# Altium project S6_Main_hv3.PrjPcb
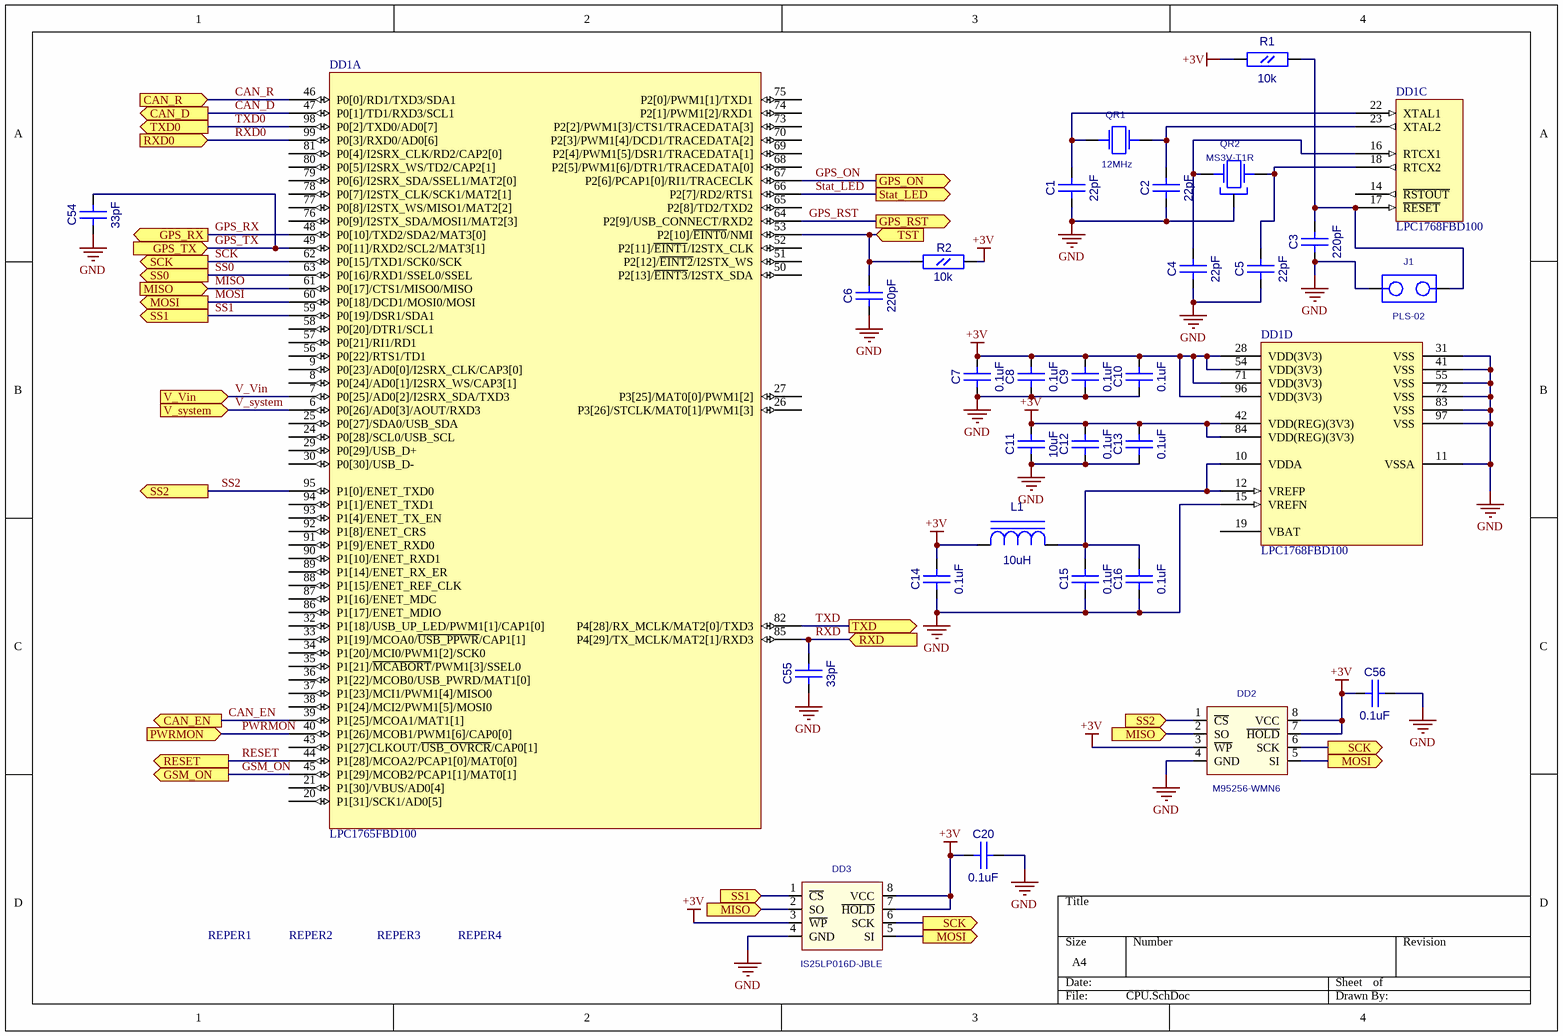
[diagram p0: CPU.SchDoc]
4 sheets, 128 parts. Net scope: flat (ports and power ports of the same name join across sheets).
Board file: S6_Main_hv3.PcbDoc
Sheets:
  CPU.SchDoc
  Interface.SchDoc
  IO.SchDoc
  Power.SchDoc

## Sheet CPU.SchDoc
size A4

### Parts
C1  22pF  [CC0603]
C2  22pF  [CC0603]
C3  220pF  [CC0603]
C4  22pF  [CC0603]
C5  22pF  [CC0603]
C6  220pF  [CC0603]
C7  0.1uF  [CC0603]
C8  0.1uF  [CC0603]
C9  0.1uF  [CC0603]
C10  0.1uF  [CC0603]
C11  10uF  [CC0805]
C12  0.1uF  [CC0603]
C13  0.1uF  [CC0603]
C14  0.1uF  [CC0603]
C15  0.1uF  [CC0603]
C16  0.1uF  [CC0603]
C20  0.1uF  [CC0603]
C54  33pF  [CC0603]
C55  33pF  [CC0603]
C56  0.1uF  [CC0603]
DD1  LPC1765FBD100  [TQFP-100]  (parts A,C,D of 4)
DD2  M95256-WMN6  [SO-8]
DD3  IS25LP016D-JBLE  [EIAJ_SO8]
J1  PLS-02  [PLS-02]
L1  10uH  [L0603]
QR1  12MHz  [AC5032_2]
QR2  MS3V-T1R  [MS3V-T1R]
R1  10k  [RC0603]
R2  10k  [RC0603]
REPER1  REPER1.2  [REPER1.2]  (value not drawn)
REPER2  REPER1.2  [REPER1.2]  (value not drawn)
REPER3  REPER1.2  [REPER1.2]  (value not drawn)
REPER4  REPER1.2  [REPER1.2]  (value not drawn)

### Ports
CAN_D (out), CAN_EN (out), CAN_R (in), GPS_ON (out), GPS_RST (out), GPS_RX (out), GPS_TX (in), GSM_ON (out), MISO (in), MOSI (out), PWRMON (in), RESET (out), RXD0 (in), RXD (in), SCK (out), SS0 (out), SS1 (in), SS1 (out), SS2 (in), SS2 (out), Stat_LED (out), TST (in), TXD0 (out), TXD (out), V_system (in), V_Vin (in)

### Nets
+3V: C7.2(B) C8.2(B) C9.2(B) C10.2(B) C11.2(B) C12.2(B) C13.2(B) C14.2(B) C20.1(A) C56.1(A) DD1.28(VDD(3V3)) DD1.42(VDD(REG)(3V3)) DD1.54(VDD(3V3)) DD1.71(VDD(3V3)) DD1.84(VDD(REG)(3V3)) DD1.96(VDD(3V3)) DD2.3(~{WP}) DD2.7(~{HOLD}) DD2.8(VCC) DD3.3(~{WP}) DD3.7(~{HOLD}) DD3.8(VCC) L1.1(A) R1.1(A) R2.1(A)
GND: C1.1(A) C2.1(A) C3.1(A) C4.1(A) C5.1(A) C6.1(A) C7.1(A) C8.1(A) C9.1(A) C10.1(A) C11.1(A) C12.1(A) C13.1(A) C14.1(A) C15.1(A) C16.1(A) C20.2(B) C54.1(A) C55.1(A) C56.2(B) DD1.11(VSSA) DD1.15(VREFN) DD1.31(VSS) DD1.41(VSS) DD1.55(VSS) DD1.72(VSS) DD1.83(VSS) DD1.97(VSS) DD2.4(GND) DD3.4(GND) J1.1 QR2.3
CAN_D: DD1.47(P0[1]/TD1/RXD3/SCL1) ; port CAN_D
CAN_EN: DD1.39(P1[25]/MCOA1/MAT1[1]) ; port CAN_EN
CAN_R: DD1.46(P0[0]/RD1/TXD3/SDA1) ; port CAN_R
GPS_ON: DD1.67(P2[6]/PCAP1[0]/RI1/TRACECLK) ; port GPS_ON
GPS_RST: DD1.64(P2[9]/USB_CONNECT/RXD2) ; port GPS_RST
GPS_RX: DD1.48(P0[10]/TXD2/SDA2/MAT3[0]) ; port GPS_RX
GPS_TX: C54.2(B) DD1.49(P0[11]/RXD2/SCL2/MAT3[1]) ; port GPS_TX
GSM_ON: DD1.45(P1[29]/MCOB2/PCAP1[1]/MAT0[1]) ; port GSM_ON
MISO: DD1.61(P0[17]/CTS1/MISO0/MISO) DD2.2(SO) DD3.2(SO) ; port MISO
MOSI: DD1.60(P0[18]/DCD1/MOSI0/MOSI) DD2.5(SI) DD3.5(SI) ; port MOSI
PWRMON: DD1.40(P1[26]/MCOB1/PWM1[6]/CAP0[0]) ; port PWRMON
RESET: DD1.44(P1[28]/MCOA2/PCAP1[0]/MAT0[0]) ; port RESET
RXD: C55.2(B) DD1.85(P4[29]/TX_MCLK/MAT2[1]/RXD3) ; port RXD
RXD0: DD1.99(P0[3]/RXD0/AD0[6]) ; port RXD0
SCK: DD1.62(P0[15]/TXD1/SCK0/SCK) DD2.6(SCK) DD3.6(SCK) ; port SCK
SS0: DD1.63(P0[16]/RXD1/SSEL0/SSEL) ; port SS0
SS1: DD1.59(P0[19]/DSR1/SDA1) DD3.1(~{CS}) ; port SS1
SS2: DD1.95(P1[0]/ENET_TXD0) DD2.1(~{CS}) ; port SS2
Stat_LED: DD1.66(P2[7]/RD2/RTS1) ; port Stat_LED
TXD: DD1.82(P4[28]/RX_MCLK/MAT2[0]/TXD3) ; port TXD
TXD0: DD1.98(P0[2]/TXD0/AD0[7]) ; port TXD0
V_system: DD1.6(P0[26]/AD0[3]/AOUT/RXD3) ; port V_system
V_Vin: DD1.7(P0[25]/AD0[2]/I2SRX_SDA/TXD3) ; port V_Vin
NetC1_2: C1.2(B) DD1.22(XTAL1) QR1.1
NetC2_2: C2.2(B) DD1.23(XTAL2) QR1.2
NetC3_2: C3.2(B) DD1.17(~{RESET}) J1.2 R1.2(B)
NetC4_2: C4.2(B) DD1.16(RTCX1) QR2.2(X2)
NetC5_2: C5.2(B) DD1.18(RTCX2) QR2.1(X1)
NetC6_2: C6.2(B) DD1.53(P2[10]/~{EINT0}/NMI) R2.2(B) ; port TST
NetC15_2: C15.2(B) C16.2(B) DD1.10(VDDA) DD1.12(VREFP) L1.2(C)

Not connected (* = marked no-connect by the designer): DD1 8(P0[24]/AD0[1]/I2SRX_WS/CAP3[1]) 9(P0[23]/AD0[0]/I2SRX_CLK/CAP3[0]) 14(~{RSTOUT}) 19(VBAT) 20(P1[31]/SCK1/AD0[5]) 21(P1[30]/VBUS/AD0[4]) 24(P0[28]/SCL0/USB_SCL) 25(P0[27]/SDA0/USB_SDA) 26(P3[26]/STCLK/MAT0[1]/PWM1[3]) 27(P3[25]/MAT0[0]/PWM1[2]) 29(P0[29]/USB_D+) 30(P0[30]/USB_D-) 32(P1[18]/USB_UP_LED/PWM1[1]/CAP1[0]) 33(P1[19]/MCOA0/~{USB_PPWR}/CAP1[1]) 34(P1[20]/MCI0/PWM1[2]/SCK0) 35(P1[21]/~{MCABORT}/PWM1[3]/SSEL0) 36(P1[22]/MCOB0/USB_PWRD/MAT1[0]) 37(P1[23]/MCI1/PWM1[4]/MISO0) 38(P1[24]/MCI2/PWM1[5]/MOSI0) 43(P1[27]CLKOUT/~{USB_OVRCR}/CAP0[1]) 50(P2[13]/~{EINT3}/I2STX_SDA) 51(P2[12]/~{EINT2}/I2STX_WS) 52(P2[11]/~{EINT1}/I2STX_CLK) 56(P0[22]/RTS1/TD1) 57(P0[21]/RI1/RD1) 58(P0[20]/DTR1/SCL1) 65(P2[8]/TD2/TXD2) 68(P2[5]/PWM1[6]/DTR1/TRACEDATA[0]) 69(P2[4]/PWM1[5]/DSR1/TRACEDATA[1]) 70(P2[3]/PWM1[4]/DCD1/TRACEDATA[2]) 73(P2[2]/PWM1[3]/CTS1/TRACEDATA[3]) 74(P2[1]/PWM1[2]/RXD1) 75(P2[0]/PWM1[1]/TXD1) 76(P0[9]/I2STX_SDA/MOSI1/MAT2[3]) 77(P0[8]/I2STX_WS/MISO1/MAT2[2]) 78(P0[7]/I2STX_CLK/SCK1/MAT2[1]) 79(P0[6]/I2SRX_SDA/SSEL1/MAT2[0]) 80(P0[5]/I2SRX_WS/TD2/CAP2[1]) 81(P0[4]/I2SRX_CLK/RD2/CAP2[0]) 86(P1[17]/ENET_MDIO) 87(P1[16]/ENET_MDC) 88(P1[15]/ENET_REF_CLK) 89(P1[14]/ENET_RX_ER) 90(P1[10]/ENET_RXD1) 91(P1[9]/ENET_RXD0) 92(P1[8]/ENET_CRS) 93(P1[4]/ENET_TX_EN) 94(P1[1]/ENET_TXD1); REPER1 1; REPER2 1; REPER3 1; REPER4 1

### Library data of the parts
C1-C10 C12-C16 C20 C54-C56 = CC0603
  C1 C2 C4 C5: Value: 22pF
  C3 C6: Value: 220pF
  C7-C10 C12-C16 C20 C56: Value: 0.1uF
  C54 C55: Value: 33pF
C11 = CC0805: Value: 10uF
DD1 = LPC1768FBD100: Cortex -M3 32-Bit Microcontroller, 512KB Flash, 64KB RAM, 100-Lead LQFP; ComponentLink1Description: Manufacturer Link; ComponentLink1URL: http://www.nxp.com/
DD2 = M95256-WMN6: SPI EEPROM; Value: *
DD3 = S25FL016A0LMFI01: Value: IS25LP016D-JBLE
L1 = L0603: Value: 10uH
QR1 = AC5032_2: AC5032/2; Value: 12MHz
QR2 = MS3V-T1R: CRYSTAL_32768 Hz; Value: *
R1 R2 = RC0603: Value: 10k
J1 = PLS-02: Value: *
REPER1-REPER4 = REPER1.2: Value: *

## Sheet Interface.SchDoc
size A4
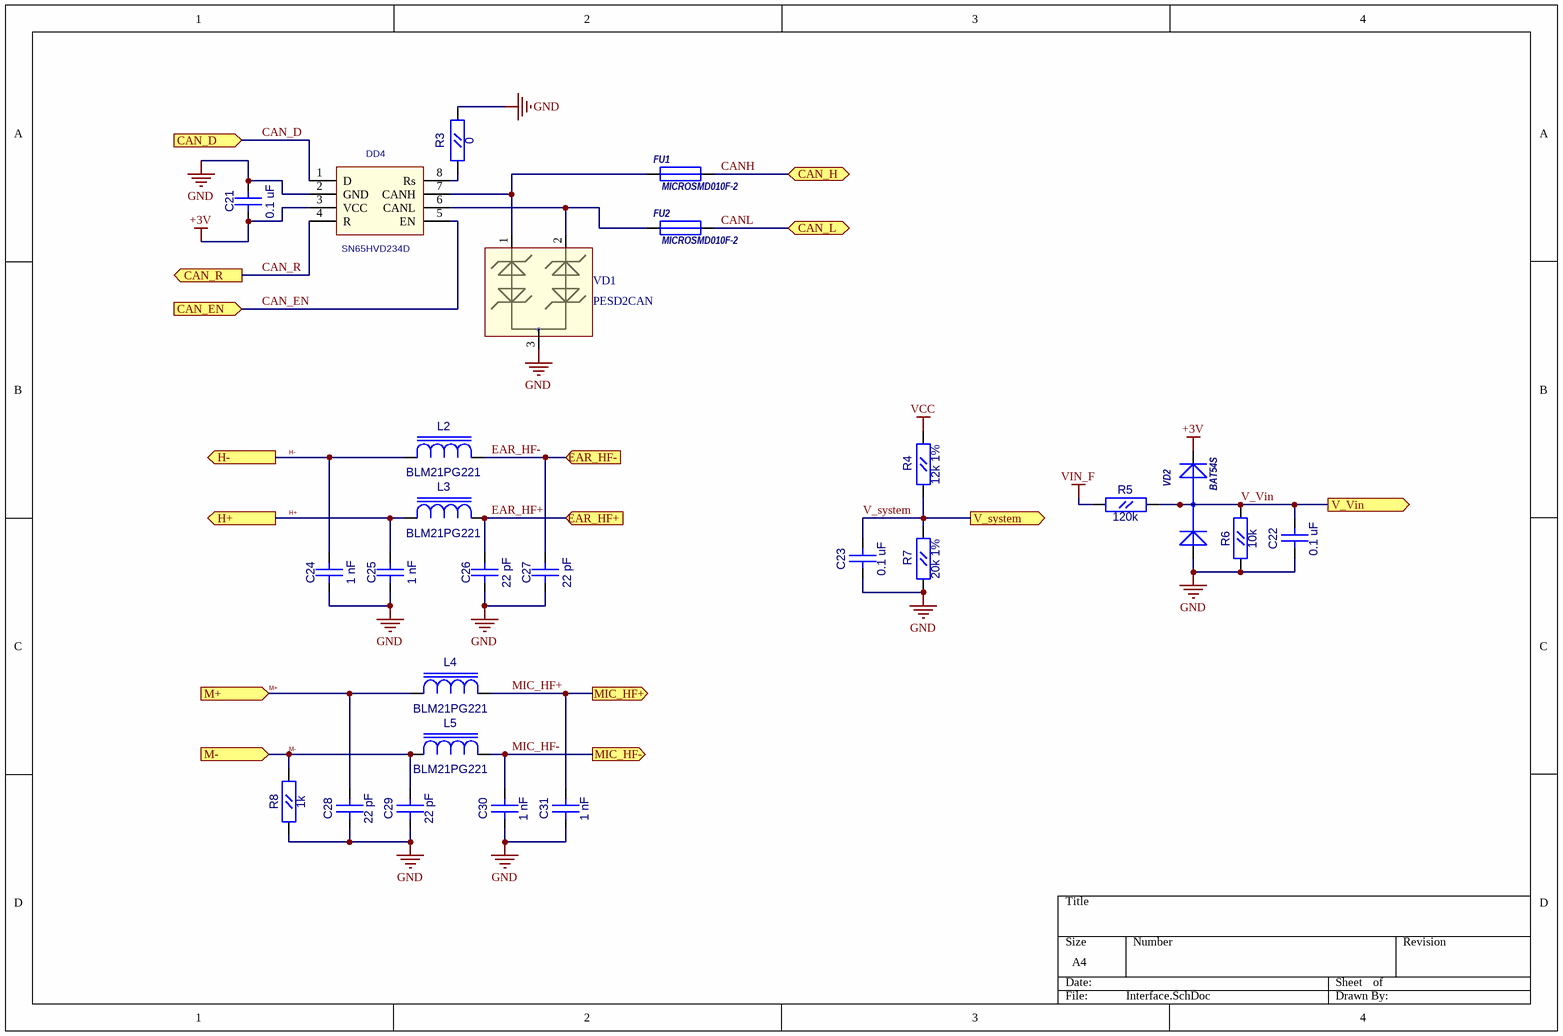
[diagram p1: Interface.SchDoc]

### Parts
C21  0.1 uF  [CC0603]
C22  0.1 uF  [CC0603]
C23  0.1 uF  [CC0603]
C24  1 nF  [CC0603]
C25  1 nF  [CC0603]
C26  22 pF  [CC0603]
C27  22 pF  [CC0603]
C28  22 pF  [CC0603]
C29  22 pF  [CC0603]
C30  1 nF  [CC0603]
C31  1 nF  [CC0603]
DD4  SN65HVD234D  [SO-8]
FU1  MICROSMD010F-2  [RC1210]
FU2  MICROSMD010F-2  [RC1210]
L2  BLM21PG221  [RC0805]
L3  BLM21PG221  [RC0805]
L4  BLM21PG221  [RC0805]
L5  BLM21PG221  [RC0805]
R3  0  [RC0603]
R4  12k 1%  [RC0603]
R5  120k  [RC0603]
R6  10k  [RC0603]
R7  20k 1%  [RC0603]
R8  1k  [RC0603]
VD1  PESD2CAN  [SOT-23(123)]
VD2  BAT54S  [SOT-23(GSD)]

### Ports
CAN_D (in), CAN_EN (in), CAN_H (bidir), CAN_L (bidir), CAN_R (out), EAR_HF+ (in), EAR_HF- (in), H+ (out), H- (out), M+ (in), M- (in), MIC_HF+ (out), MIC_HF- (out), V_system (out), V_Vin (out)

### Nets
+3V: C21.1(A) DD4.3(VCC) VD2.2(K)
GND: C21.2(B) C22.2(B) C23.2(B) C24.1(A) C25.1(A) C26.1(A) C27.1(A) C28.1(A) C29.1(A) C30.1(A) C31.1(A) DD4.2(GND) R3.2(B) R6.2(B) R7.1(A) R8.1(A) VD1.3 VD2.1(A)
VCC: R4.2(B)
VIN_F: R5.2(B)
CAN_D: DD4.1(D) ; port CAN_D
CAN_EN: DD4.5(EN) ; port CAN_EN
CAN_R: DD4.4(R) ; port CAN_R
CANH: FU1.2 ; port CAN_H
CANL: FU2.2 ; port CAN_L
EAR_HF+: C26.2(B) L3.1(A) ; port EAR_HF+
EAR_HF-: C27.2(B) L2.1(A) ; port EAR_HF-
H+: C25.2(B) L3.2(B) ; port H+
H-: C24.2(B) L2.2(B) ; port H-
M+: C28.2(B) L4.1(A) ; port M+
M-: C29.2(B) L5.1(A) R8.2(B) ; port M-
MIC_HF+: C31.2(B) L4.2(B) ; port MIC_HF+
MIC_HF-: C30.2(B) L5.2(B) ; port MIC_HF-
V_system: C23.1(A) R4.1(A) R7.2(B) ; port V_system
V_Vin: C22.1(A) R5.1(A) R6.1(A) VD2.3(AK) ; port V_Vin
NetDD4_6: DD4.6(CANL) FU2.1 VD1.2
NetDD4_7: DD4.7(CANH) FU1.1 VD1.1
NetDD4_8: DD4.8(Rs) R3.1(A)

### Library data of the parts
C21-C31 = CC0603
  C21-C23: Value: 0.1 uF
  C24 C25 C30 C31: Value: 1 nF
  C26-C29: Value: 22 pF
DD4 = SN65HVD234D: CAN Transceiver; Value: *
FU1 FU2 = MICROSMD: Value: MICROSMD010F-2
R3-R8 = RC0603
  R3: Value: 0
  R4: Value: 12k 1%
  R5: Value: 120k
  R6: Value: 10k
  R7: Value: 20k 1%
  R8: Value: 1k
VD1 = PESD2CAN: TVS for CAN
VD2 = BAT54S: 1.0 Ampere General Purpose Rectifier; ComponentField6: Published 8-Jun-2000, Modified 11-July-2000: SIM Model Added.; Value: *

## Sheet IO.SchDoc
size A4
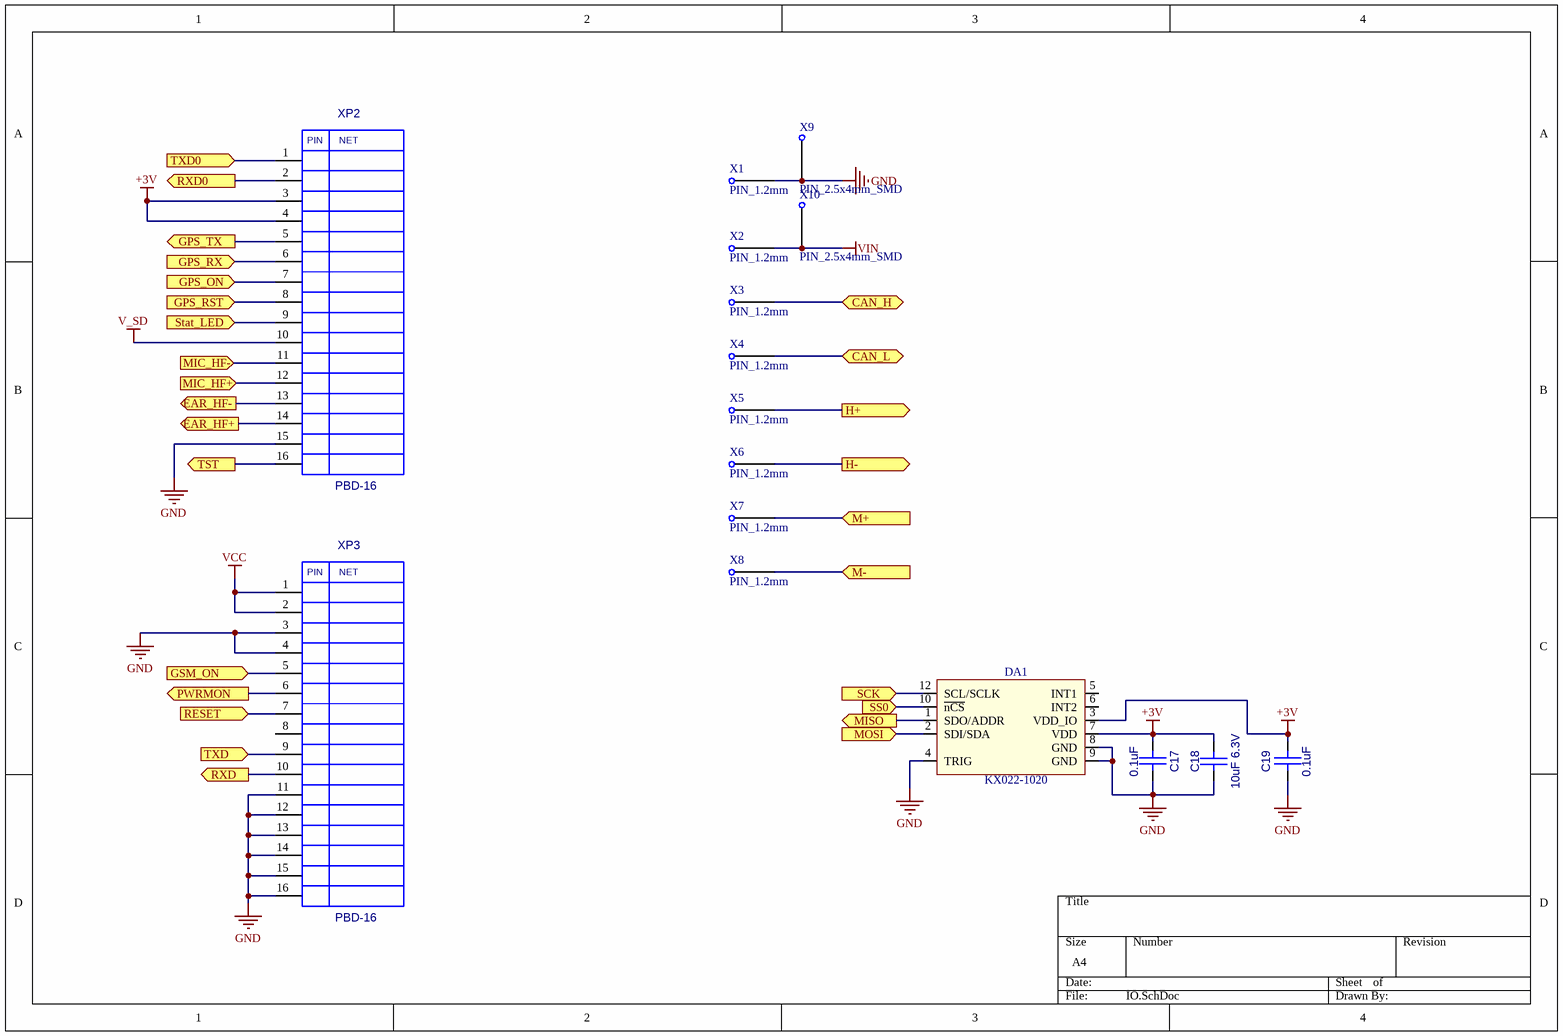
[diagram p2: IO.SchDoc]

### Parts
C17  0.1uF  [CC0603]
C18  10uF 6.3V  [CC0805]
C19  0.1uF  [CC0603]
DA1  KX022-1020  [LGA-12]
X1  PIN_1.2mm  [PIN_1.2mm]
X2  PIN_1.2mm  [PIN_1.2mm]
X3  PIN_1.2mm  [PIN_1.2mm]
X4  PIN_1.2mm  [PIN_1.2mm]
X5  PIN_1.2mm  [PIN_1.2mm]
X6  PIN_1.2mm  [PIN_1.2mm]
X7  PIN_1.2mm  [PIN_1.2mm]
X8  PIN_1.2mm  [PIN_1.2mm]
X9  PIN_2.5x4mm_SMD  [PIN_2.5x4mm_SMD]
X10  PIN_2.5x4mm_SMD  [PIN_2.5x4mm_SMD]
XP2  PBD-16  [PBD16]
XP3  PBD-16  [PBD16]

### Ports
CAN_H (bidir), CAN_L (bidir), EAR_HF+ (out), EAR_HF- (out), GPS_ON (in), GPS_RST (in), GPS_RX (in), GPS_TX (out), GSM_ON (in), H+ (out), H- (out), M+ (in), M- (in), MIC_HF+ (in), MIC_HF- (in), MISO (out), MOSI (in), PWRMON (out), RESET (in), RXD0 (out), RXD (out), SCK (in), SS0 (in), Stat_LED (in), TST (out), TXD0 (in), TXD (in)

### Nets
+3V: C17.1(A) C18.2(B) C19.1(A) DA1.3(VDD_IO) DA1.7(VDD) XP2.3 XP2.4
GND: C17.2(B) C18.1(A) C19.2(B) DA1.4(TRIG) DA1.8(GND) DA1.9(GND) X1.1 X9.1 XP2.15 XP3.3 XP3.4 XP3.11 XP3.12 XP3.13 XP3.14 XP3.15 XP3.16
V_SD: XP2.10
VCC: XP3.1 XP3.2
VIN: X2.1 X10.1
CANH: X3.1 ; port CAN_H
CANL: X4.1 ; port CAN_L
EAR_HF+: XP2.14 ; port EAR_HF+
EAR_HF-: XP2.13 ; port EAR_HF-
GPS_ON: XP2.7 ; port GPS_ON
GPS_RST: XP2.8 ; port GPS_RST
GPS_RX: XP2.6 ; port GPS_RX
GPS_TX: XP2.5 ; port GPS_TX
GSM_ON: XP3.5 ; port GSM_ON
H+: X5.1 ; port H+
H-: X6.1 ; port H-
M+: X7.1 ; port M+
M-: X8.1 ; port M-
MIC_HF+: XP2.12 ; port MIC_HF+
MIC_HF-: XP2.11 ; port MIC_HF-
MISO: DA1.1(SDO/ADDR) ; port MISO
MOSI: DA1.2(SDI/SDA) ; port MOSI
PWRMON: XP3.6 ; port PWRMON
RESET: XP3.7 ; port RESET
RXD: XP3.10 ; port RXD
RXD0: XP2.2 ; port RXD0
SCK: DA1.12(SCL/SCLK) ; port SCK
SS0: DA1.10(~{nCS}) ; port SS0
Stat_LED: XP2.9 ; port Stat_LED
TXD: XP3.9 ; port TXD
TXD0: XP2.1 ; port TXD0
NetC6_2: XP2.16 ; port TST

Not connected (* = marked no-connect by the designer): DA1 5(INT1) 6(INT2); XP3 8

### Notes on the sheet
- (in symbol PBD-16) PIN; NET

### Library data of the parts
C17 C19 = CC0603: Value: 0.1uF
C18 = CC0805: Value: 10uF 6.3V
DA1 = KX022-1020: Value: KX022-1020
XP2 XP3 = PBD-16: Value: *

## Sheet Power.SchDoc
size A4
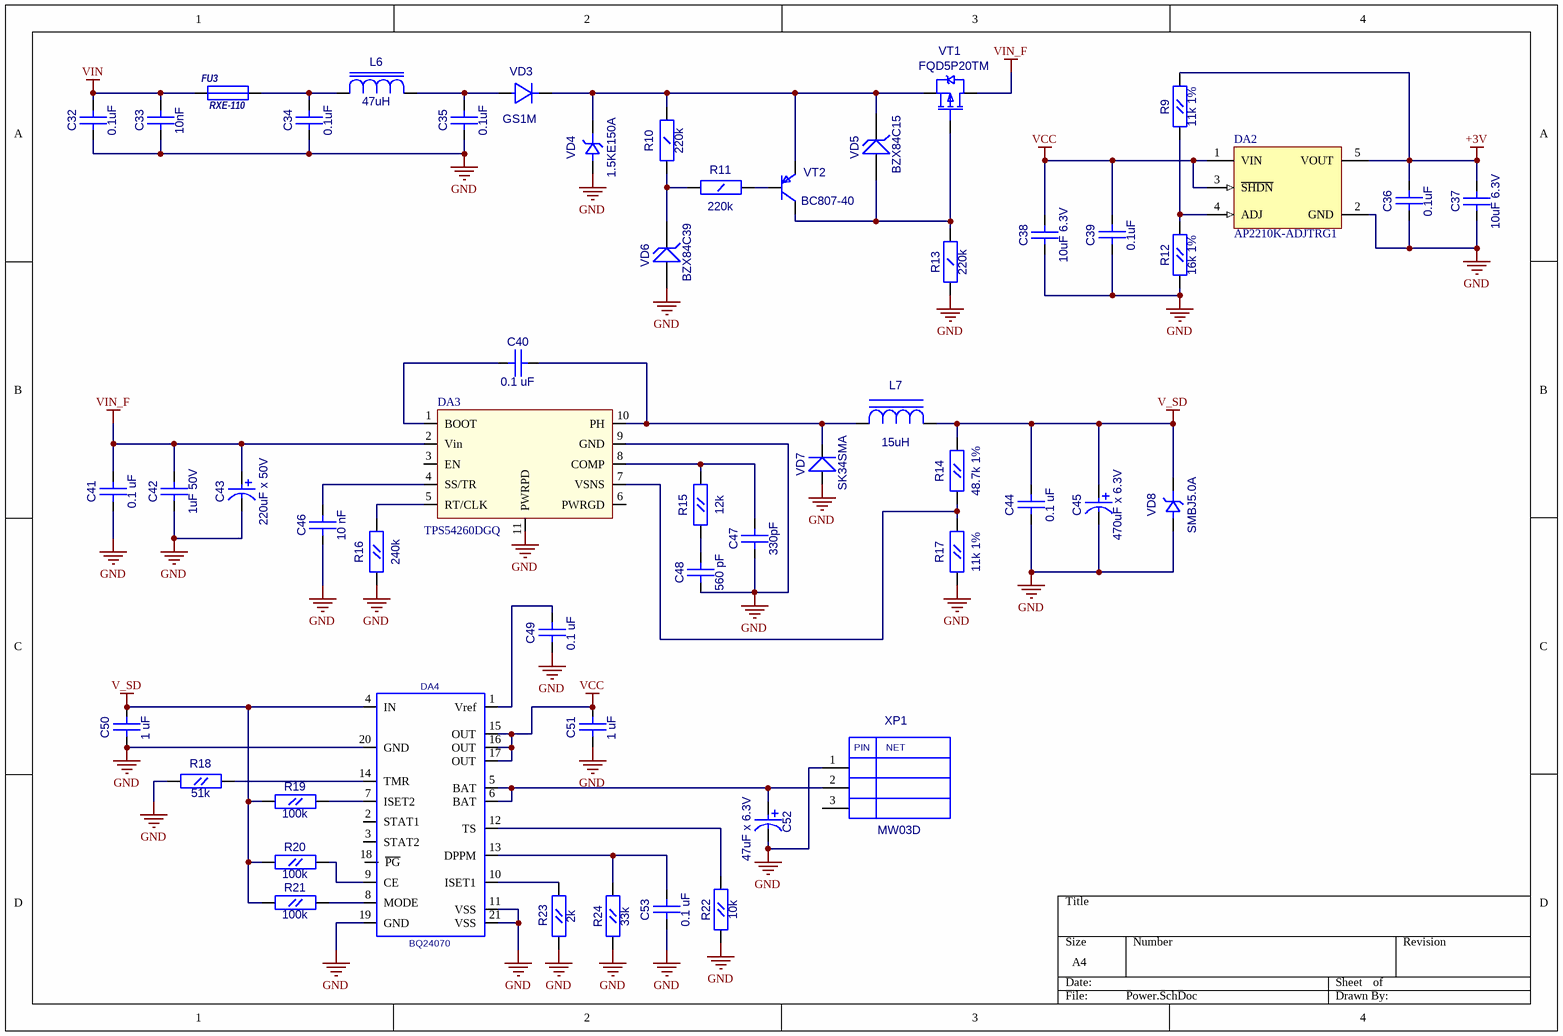
[diagram p3: Power.SchDoc]

### Parts
C32  0.1uF  [CC1206]
C33  10nF  [CC1206]
C34  0.1uF  [CC1206]
C35  0.1uF  [CC1206]
C36  0.1uF  [CC0603]
C37  10uF 6.3V  [CC0805]
C38  10uF 6.3V  [CC0805]
C39  0.1uF  [CC0603]
C40  0.1 uF  [CC0603]
C41  0.1 uF  [CC0603]
C42  1uF 50V  [CC1206]
C43  220uF x 50V  [CC16X10_CAP0.5(1)(Primary)]
C44  0.1 uF  [CC0603]
C45  470uF x 6.3V  [TAJ-D-1M]
C46  10 nF  [CC0603]
C47  330pF  [CC0603]
C48  560 pF  [CC0603]
C49  0.1 uF  [CC0603]
C50  1 uF  [CC0603]
C51  1 uF  [CC0603]
C52  47uF x 6.3V  [TAJ-A_M]
C53  0.1 uF  [CC0603]
DA2  AP2210K-ADJTRG1  [SOT23-5]
DA3  TPS54260DGQ  [S-PDSO-G10]
DA4  BQ24070  [P-PQFP-N20]
FU3  RXE-110  [RXE-110]
L6  47uH  [SDR0603]
L7  15uH  [SDR0805]
R9  11k 1%  [RC0603]
R10  220k  [RC1206]
R11  220k  [RC1206]
R12  16k 1%  [RC0603]
R13  220k  [RC1206]
R14  48.7k 1%  [RC0603]
R15  12k  [RC0603]
R16  240k  [RC0603]
R17  11k 1%  [RC0603]
R18  51k  [RC0603]
R19  100k  [RC0603]
R20  100k  [RC0603]
R21  100k  [RC0603]
R22  10k  [RC0603]
R23  2k  [RC0603]
R24  33k  [RC0603]
VD3  GS1M  [SMA]
VD4  1.5KE150A  [DO-201]
VD5  BZX84C15  [SOT-23(123)]
VD6  BZX84C39  [SOT-23(123)]
VD7  SK34SMA  [SMA]
VD8  SMBJ5.0A  [SMB]
VT1  FQD5P20TM  [D-PAK(TO-252AA)]
VT2  BC807-40  [SOT-23(123)]
XP1  MW03D  [MW03D]

### Nets
+3V: C36.1(A) C37.2(B) DA2.5(VOUT) R9.2(B)
GND: C32.1(A) C33.1(A) C34.1(A) C35.1(A) C36.2(B) C37.1(A) C38.1(A) C39.2(B) C41.1(A) C42.1(A) C43.1 C44.2(B) C45.2(B) C46.1(A) C47.1(A) C48.1(A) C49.2(B) C50.2(B) C51.2(B) C52.2(B) C53.2(B) DA2.2(GND) DA3.9(GND) DA3.11(PWRPD) DA4.11(VSS) DA4.19(GND) DA4.20(GND) DA4.21(VSS) R12.1(A) R13.2(B) R16.1(A) R17.1(A) R18.1(A) R22.1(A) R23.1(A) R24.1(A) VD4.1(A) VD6.1(A) VD7.1(A) VD8.1(A) XP1.1
V_SD: C44.1(A) C45.1(A) C50.1(A) DA4.4(IN) L7.2(A) R14.2(B) R19.1(A) R20.1(A) R21.1(A) VD8.2(K)
VCC: C38.2(B) C39.1(A) C51.1(A) DA2.1(VIN) DA2.3(~{SHDN}) DA4.15(OUT) DA4.16(OUT) DA4.17(OUT)
VIN: C32.2(B) C33.2(B) FU3.1
VIN_F: C41.2(B) C42.2(B) C43.2 DA3.2(Vin) VT1.3(D)
NetC34_2: C34.2(B) FU3.2 L6.1
NetC35_2: C35.2(B) L6.2 VD3.1(A)
NetC40_1: C40.1(A) DA3.1(BOOT)
NetC40_2: C40.2(B) DA3.10(PH) L7.1(C) VD7.2(K)
NetC46_2: C46.2(B) DA3.4(SS/TR)
NetC47_2: C47.2(B) DA3.8(COMP) R15.2(B)
NetC48_2: C48.2(B) R15.1(A)
NetC49_1: C49.1(A) DA4.1(Vref)
NetC52_1: C52.1(A) DA4.5(BAT) DA4.6(BAT) XP1.2
NetC53_1: C53.1(A) DA4.13(DPPM) R24.2(B)
NetDA2_4: DA2.4(ADJ) R9.1(A) R12.2(B)
NetDA3_5: DA3.5(RT/CLK) R16.2(B)
NetDA3_7: DA3.7(VSNS) R14.1(A) R17.2(B)
NetDA4_7: DA4.7(ISET2) R19.2(B)
NetDA4_8: DA4.8(MODE) R21.2(B)
NetDA4_9: DA4.9(CE) R20.2(B)
NetDA4_10: DA4.10(ISET1) R23.2(B)
NetDA4_12: DA4.12(TS) R22.2(B)
NetDA4_14: DA4.14(TMR) R18.2(B)
NetR10_1: R10.1(A) R11.1(A) VD6.3(K)
NetR10_2: R10.2(B) VD3.2(K) VD4.2(K) VD5.3(K) VT1.2(S) VT2.2(E)
NetR11_2: R11.2(B) VT2.1(B)
NetR13_1: R13.1(A) VD5.1(A) VT1.1(G) VT2.3(C)

Not connected (* = marked no-connect by the designer): DA3 3(EN) 6(PWRGD); DA4 2(STAT1) 3(STAT2) 18(~{PG}); XP1 3

### Notes on the sheet
- (in symbol MW03D) PIN; NET

### Library data of the parts
C32-C35 C42 = CC1206
  C32 C34 C35: Value: 0.1uF
  C33: Value: 10nF
  C42: Value: 1uF 50V
C36 C39-C41 C44 C46-C51 C53 = CC0603
  C36 C39: Value: 0.1uF
  C40 C41 C44 C49 C53: Value: 0.1 uF
  C46: Value: 10 nF
  C47: Value: 330pF
  C48: Value: 560 pF
  C50 C51: Value: 1 uF
C37 C38 = CC0805: Value: 10uF 6.3V
C43 = CAP0.5(1): Value: 220uF x 50V
C45 = TAJ-D: Value: 470uF x 6.3V
C52 = TAJ-A: Value: {Value}
DA2 = MCP1824T-ADJE/OT: 300 mA, Low Voltage, Low Quiescent Current LDO Regulator, 5-Pin SOT-223, Extended Temperature, Tape and Reel; Published: 29-Jan-2009; DatasheetVersion: revA, Aug-2007; PackageVersion: revAW, Oct-2008; PackageReference: SOT-223-DC5; Publisher: Altium Limited; PackageDescription: 5-Lead Plastic Small Outline Transistor (DC) [SOT-223]; ComponentLink1Description: Manufacturer Link; ComponentLink1URL: http://www.microchip.com; ComponentLink2Description: Datasheet; ComponentLink2URL: http://ww1.microchip.com/downloads/en/DeviceDoc/22070a.pdf; ComponentLink3Description: Packaging Specification; ComponentLink3URL: http://ww1.microchip.com/downloads/en/PackagingSpec/00049AW.pdf
L6 = SDR0603: Value: 47uH
L7 = SDR0805: Value: 15uH
R9 R12 R14-R17 R19-R24 = RC0603
  R9 R17: Value: 11k 1%
  R12: Value: 16k 1%
  R14: Value: 48.7k 1%
  R15: Value: 12k
  R16: Value: 240k
  R19-R21: Value: 100k
  R22: Value: 10k
  R23: Value: 2k
  R24: Value: 33k
R10 R11 R13 = RC1206: Value: 220k
R18 = RC0603: Value: {Value}
VD3 = GS1M: Value: {Value}
VD4 = 1.5KE: Value: 1.5KE150A
VD5 VD6 = BZX84: Zener Voltage Regulator Diode; Value: {Value}
VD7 = SK34SMA: Schottky Rectifier; Value: {Value}
VD8 = SMBJ: Value: *
VT1 = IRFR9220: HEXFET Power MOSFET; OriginalName: IRLML5103; ComponentField7: Published 8-Jun-2000; Value: FQD5P20TM
VT2 = BC857B: OriginalName: BC846BLT1; ComponentField7: Published 29-Sep-2000; Value: BC807-40
DA4 = BQ24070: Value: *
FU3 = RXE-110: Value: *
XP1 = MW03D: Value: *

## Nets that join several sheets
+3V: CPU (25 pins), Interface (C21.1 DD4.3 VD2.2), IO (7 pins), Power (C36.1 C37.2 DA2.5 R9.2)
GND: CPU (32 pins), Interface (18 pins), IO (17 pins), Power (41 pins)
V_SD: IO (XP2.10), Power (10 pins)
VCC: Interface (R4.2), IO (XP3.1 XP3.2), Power (8 pins)
VIN: IO (X2.1 X10.1), Power (C32.2 C33.2 FU3.1)
VIN_F: Interface (R5.2), Power (5 pins)
CAN_D: CPU (DD1.47), Interface (DD4.1)
CAN_EN: CPU (DD1.39), Interface (DD4.5)
CAN_R: CPU (DD1.46), Interface (DD4.4)
CANH: Interface (FU1.2), IO (X3.1)
CANL: Interface (FU2.2), IO (X4.1)
EAR_HF+: Interface (C26.2 L3.1), IO (XP2.14)
EAR_HF-: Interface (C27.2 L2.1), IO (XP2.13)
GPS_ON: CPU (DD1.67), IO (XP2.7)
GPS_RST: CPU (DD1.64), IO (XP2.8)
GPS_RX: CPU (DD1.48), IO (XP2.6)
GPS_TX: CPU (C54.2 DD1.49), IO (XP2.5)
GSM_ON: CPU (DD1.45), IO (XP3.5)
H+: Interface (C25.2 L3.2), IO (X5.1)
H-: Interface (C24.2 L2.2), IO (X6.1)
M+: Interface (C28.2 L4.1), IO (X7.1)
M-: Interface (C29.2 L5.1 R8.2), IO (X8.1)
MIC_HF+: Interface (C31.2 L4.2), IO (XP2.12)
MIC_HF-: Interface (C30.2 L5.2), IO (XP2.11)
MISO: CPU (DD1.61 DD2.2 DD3.2), IO (DA1.1)
MOSI: CPU (DD1.60 DD2.5 DD3.5), IO (DA1.2)
NetC6_2: CPU (C6.2 DD1.53 R2.2), IO (XP2.16)
PWRMON: CPU (DD1.40), IO (XP3.6)
RESET: CPU (DD1.44), IO (XP3.7)
RXD: CPU (C55.2 DD1.85), IO (XP3.10)
RXD0: CPU (DD1.99), IO (XP2.2)
SCK: CPU (DD1.62 DD2.6 DD3.6), IO (DA1.12)
SS0: CPU (DD1.63), IO (DA1.10)
Stat_LED: CPU (DD1.66), IO (XP2.9)
TXD: CPU (DD1.82), IO (XP3.9)
TXD0: CPU (DD1.98), IO (XP2.1)
V_system: CPU (DD1.6), Interface (C23.1 R4.1 R7.2)
V_Vin: CPU (DD1.7), Interface (C22.1 R5.1 R6.1 VD2.3)